# Altium schematic sheet FSR.SchDoc
size A3; SheetNumber: 4; SheetTotal: 5
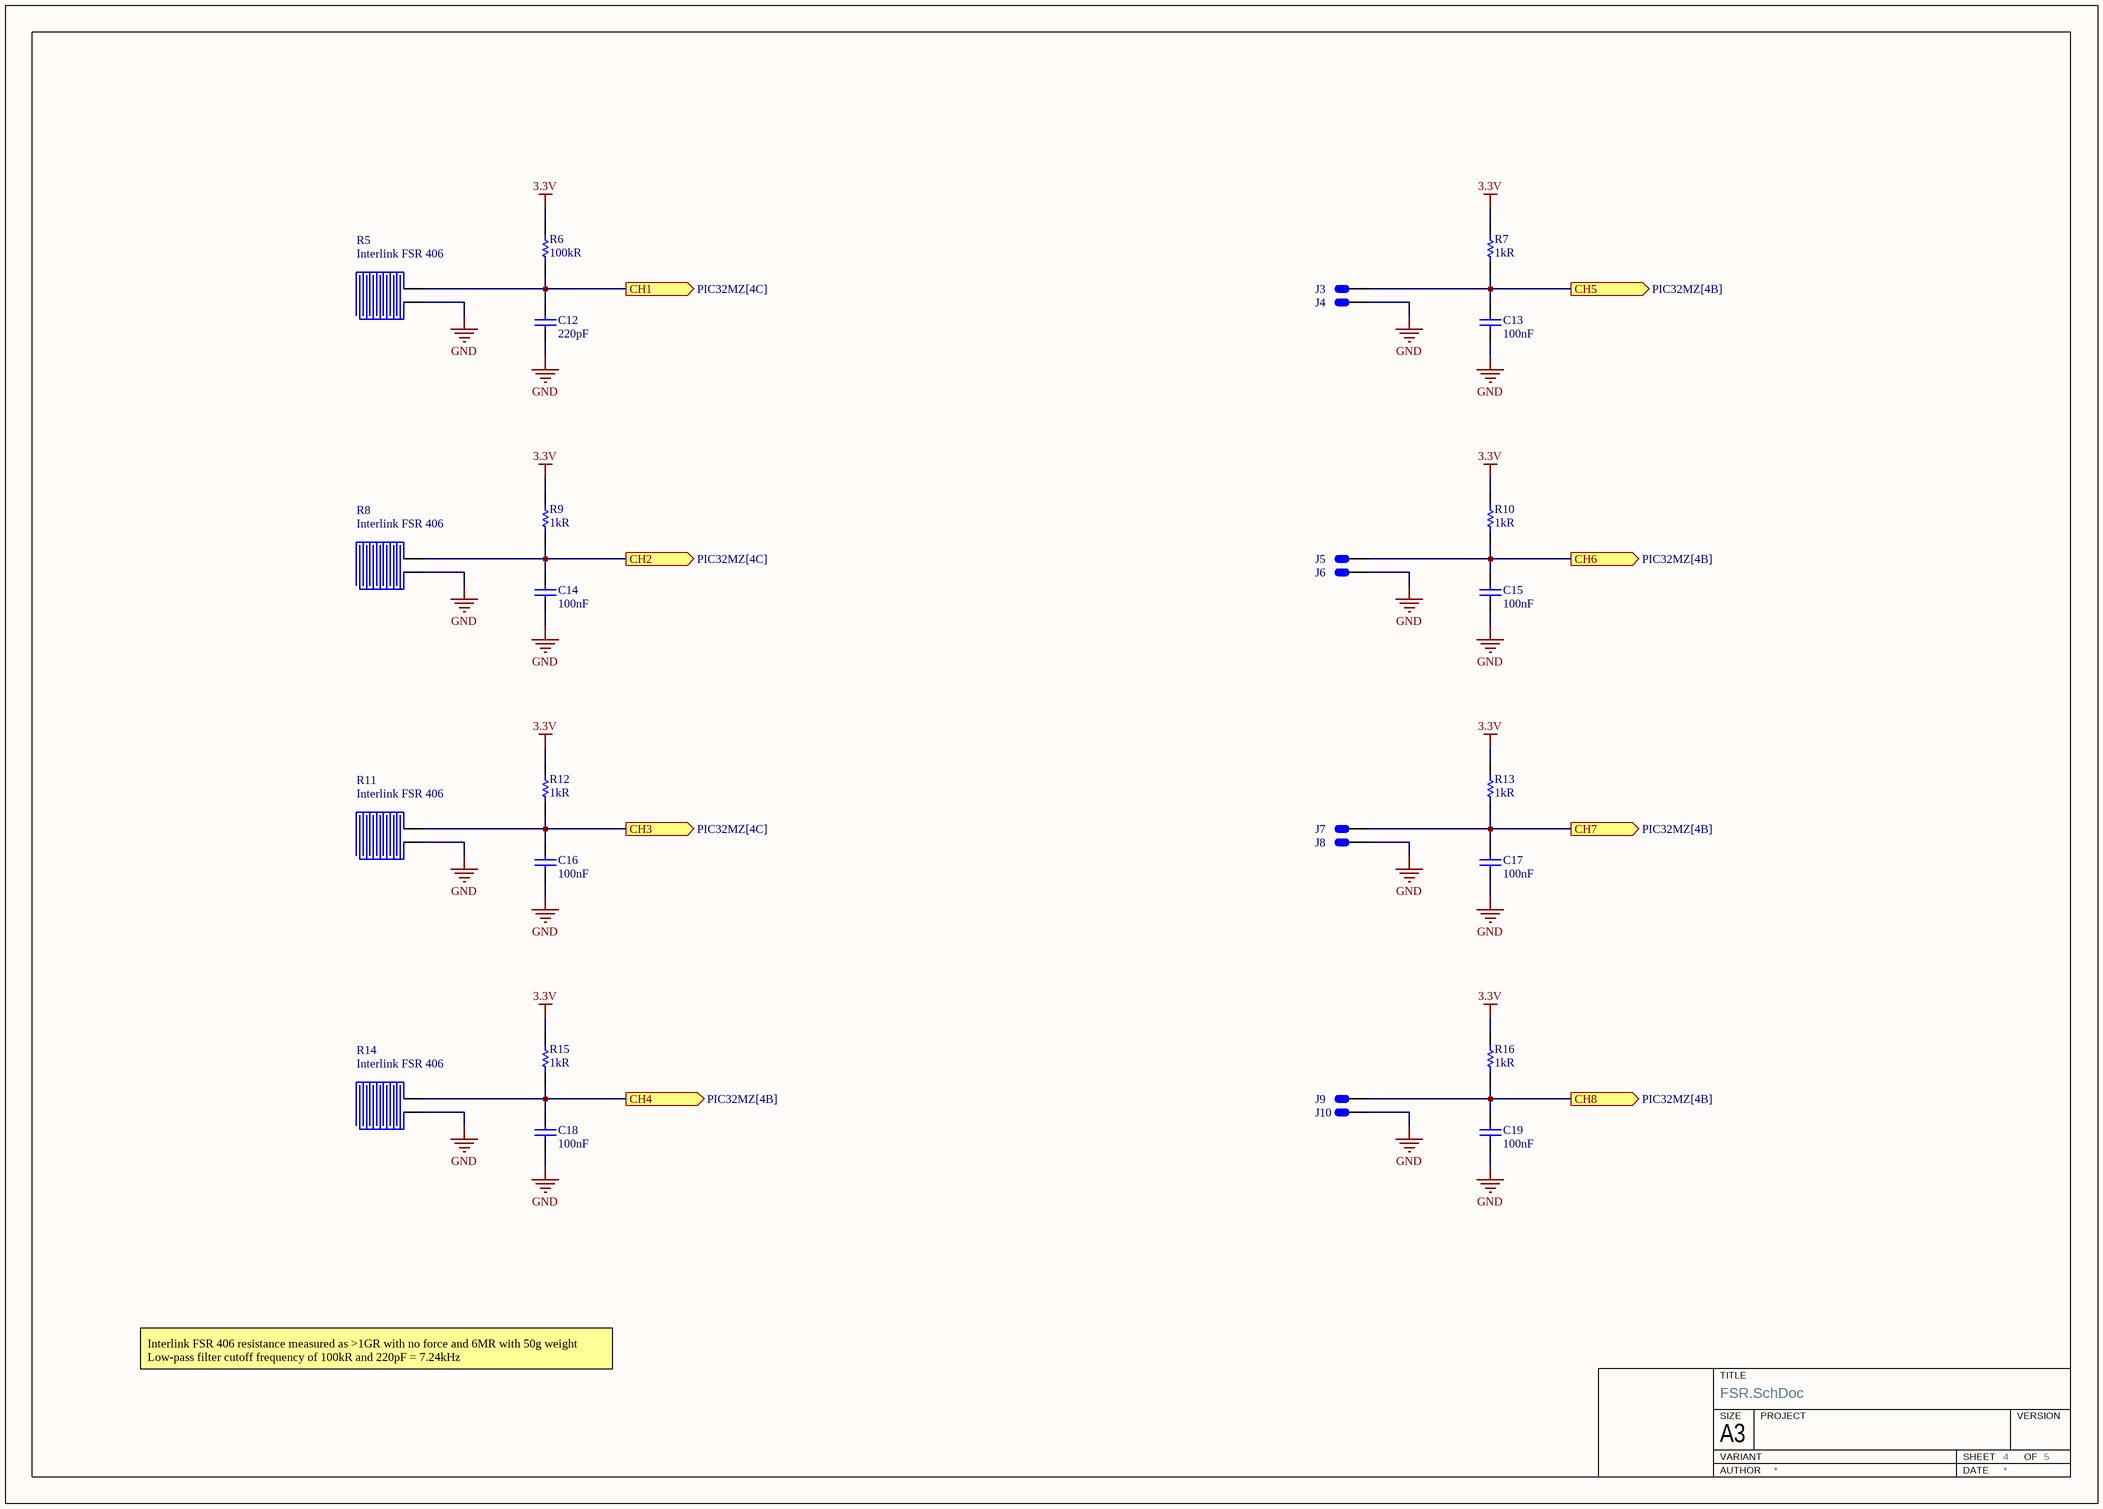
[diagram p0: FSR.SchDoc]

## Parts
C12  220pF  [Capacitor 0402]
C13  100nF  [Capacitor 0402]
C14  100nF  [Capacitor 0402]
C15  100nF  [Capacitor 0402]
C16  100nF  [Capacitor 0402]
C17  100nF  [Capacitor 0402]
C18  100nF  [Capacitor 0402]
C19  100nF  [Capacitor 0402]
J3  Wire Solder Pad  [Wire Solder Pad 3x1.5mm]  (value not drawn)
J4  Wire Solder Pad  [Wire Solder Pad 3x1.5mm]  (value not drawn)
J5  Wire Solder Pad  [Wire Solder Pad 3x1.5mm]  (value not drawn)
J6  Wire Solder Pad  [Wire Solder Pad 3x1.5mm]  (value not drawn)
J7  Wire Solder Pad  [Wire Solder Pad 3x1.5mm]  (value not drawn)
J8  Wire Solder Pad  [Wire Solder Pad 3x1.5mm]  (value not drawn)
J9  Wire Solder Pad  [Wire Solder Pad 3x1.5mm]  (value not drawn)
J10  Wire Solder Pad  [Wire Solder Pad 3x1.5mm]  (value not drawn)
R5  Interlink FSR 406  [Interlink FSR 406]
R6  100kR  [Resistor 0402]
R7  1kR  [Resistor 0402]
R8  Interlink FSR 406  [Interlink FSR 406]
R9  1kR  [Resistor 0402]
R10  1kR  [Resistor 0402]
R11  Interlink FSR 406  [Interlink FSR 406]
R12  1kR  [Resistor 0402]
R13  1kR  [Resistor 0402]
R14  Interlink FSR 406  [Interlink FSR 406]
R15  1kR  [Resistor 0402]
R16  1kR  [Resistor 0402]

## Ports
CH1 (out, see PIC32MZ[4C]), CH2 (out, see PIC32MZ[4C]), CH3 (out, see PIC32MZ[4C]), CH4 (out, see PIC32MZ[4B]), CH5 (out, see PIC32MZ[4B]), CH6 (out, see PIC32MZ[4B]), CH7 (out, see PIC32MZ[4B]), CH8 (out, see PIC32MZ[4B])

## Nets
3.3V: R6.2 R7.2 R9.2 R10.2 R12.2 R13.2 R15.2 R16.2
GND: C12.1 C13.1 C14.1 C15.1 C16.1 C17.1 C18.1 C19.1 J4.1 J6.1 J8.1 J10.1 R5.2 R8.2 R11.2 R14.2
CH1: C12.2 R5.1 R6.1 ; port CH1
CH2: C14.2 R8.1 R9.1 ; port CH2
CH3: C16.2 R11.1 R12.1 ; port CH3
CH4: C18.2 R14.1 R15.1 ; port CH4
CH5: C13.2 J3.1 R7.1 ; port CH5
CH6: C15.2 J5.1 R10.1 ; port CH6
CH7: C17.2 J7.1 R13.1 ; port CH7
CH8: C19.2 J9.1 R16.1 ; port CH8

## Notes on the sheet
- Interlink FSR 406 resistance measured as >1GR with no force and 6MR with 50g weight
  Low-pass filter cutoff frequency of 100kR and 220pF = 7.24kHz
- TITLE
- SIZE
- A3
- VARIANT
- PROJECT
- SHEET
- VERSION
- OF
- AUTHOR
- DATE

## Library data of the parts
C12-C19 = Capacitor
R6 R7 R9 R10 R12 R13 R15 R16 = Resistor